# Altium schematic sheet Magnetometer_Channel.SchDoc: Hrafn
size Tabloid; DrawnBy: Nicholas Belsten; Organization: MIT; Address1: Route 40; Address2: Westford MA 01886; Address3: USA; DocumentNumber: 3; SheetNumber: 4; SheetTotal: 10; DCN: Aika; ProgramName: AERO-VISTA; Section: Magnetometer Channel
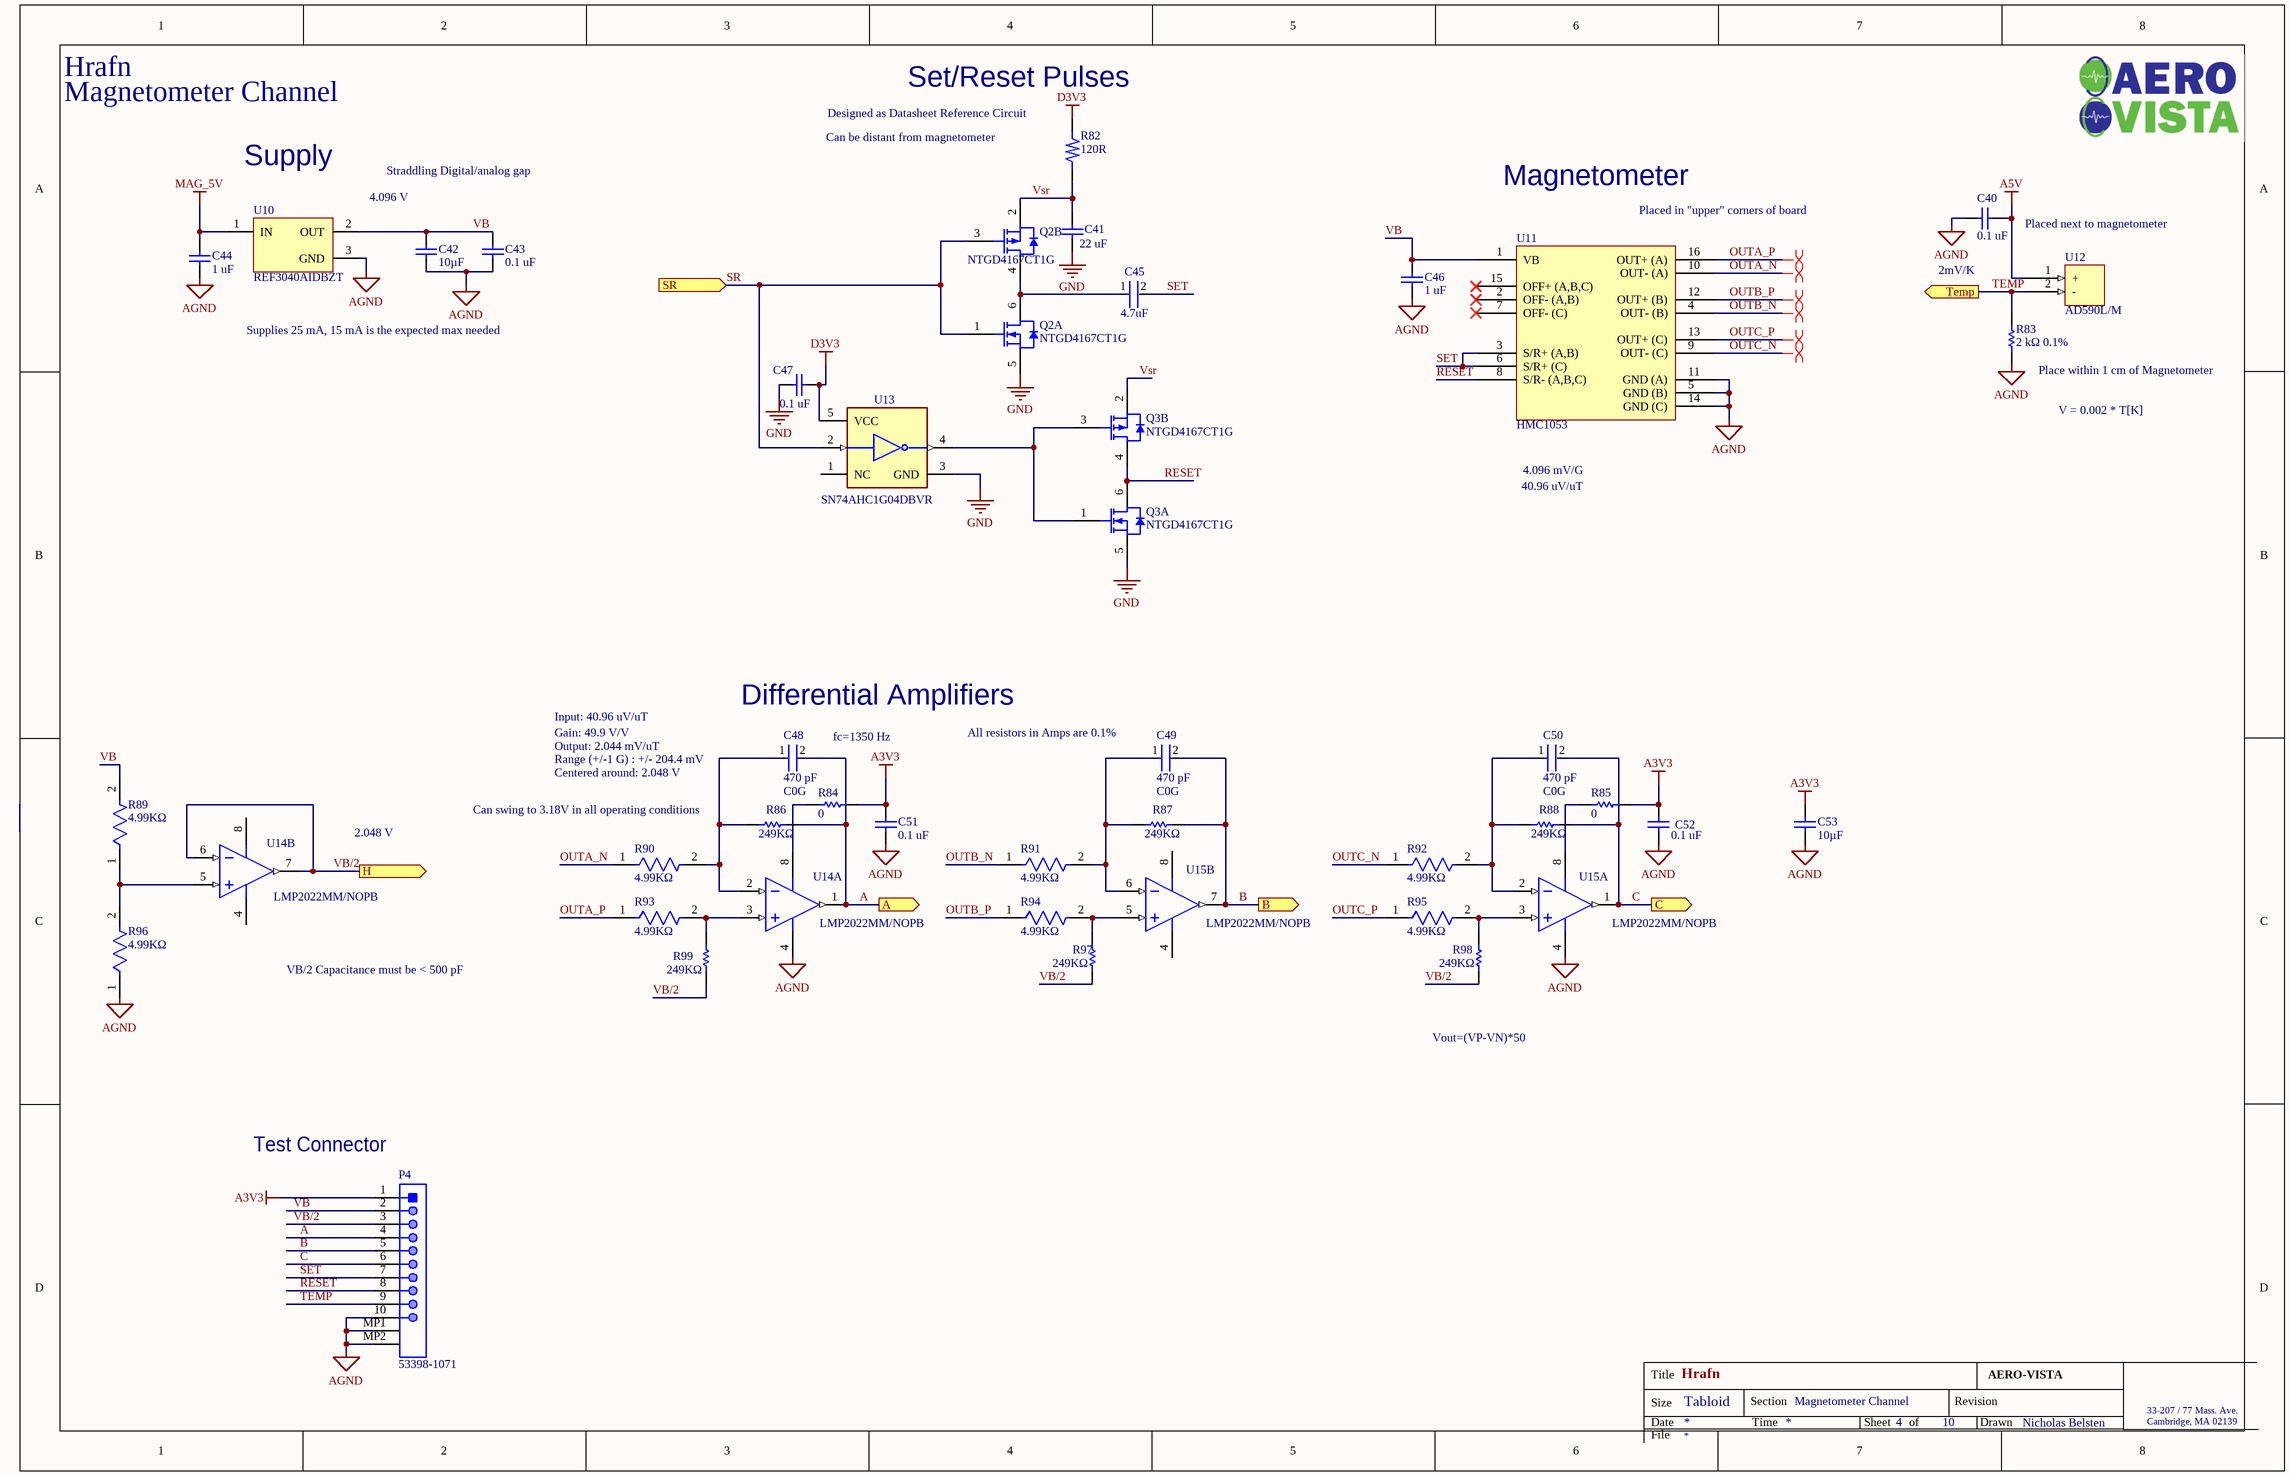
[diagram p0: Magnetometer_Channel.SchDoc]

## Parts
C40  0.1 uF  [CAPC0402(1005)60_L]
C41  Capacitance: 22 uF  [CAPC2013X95X45LL15T25]  (hidden comment: GRM219R61A226MEA0D)
C42  Capacitance: 10µF  [CAPC1608X100X35LL20T25]  (hidden comment: EMK107BBJ106MA-T)
C43  0.1 uF  [CAPC0402(1005)60_L]
C44  1 uF  [CAPC1005X60X30NL05T10]
C45  Capacitance: 4.7uF  [FP-GRM188-0_2-IPC_C]  (hidden comment: GRM188R6YA475KE15D)
C46  1 uF  [CAPC1005X60X30NL05T10]
C47  0.1 uF  [CAPC0402(1005)60_L]
C48  Capacitance: 470 pF  Temperature Characteristic: C0G  [FP-C0402-BB-MFG]  (hidden comment: C0402C471F5GACTU)
C49  Capacitance: 470 pF  Temperature Characteristic: C0G  [FP-C0402-BB-MFG]  (hidden comment: C0402C471F5GACTU)
C50  Capacitance: 470 pF  Temperature Characteristic: C0G  [FP-C0402-BB-MFG]  (hidden comment: C0402C471F5GACTU)
C51  0.1 uF  [CAPC0402(1005)60_L]
C52  0.1 uF  [CAPC0402(1005)60_L]
C53  Capacitance: 10µF  [CAPC1608X100X35LL20T25]  (hidden comment: EMK107BBJ106MA-T)
P4  53398-1071  [MOLX-53398-1071_V]
Q2  NTGD4167CT1G  [ONSC-TSOP-6-318G-02_V]  (parts A,B of 2)
Q3  NTGD4167CT1G  [ONSC-TSOP-6-318G-02_V]  (parts A,B of 2)
R82  Resistance: 120R  [RESC1608X08L]  (hidden comment: R)
R83  2 kΩ 0.1%  [RESC1005X40X25LL10T10]
R84  0  [RESC1608X55X25NL10T15]
R85  0  [RESC1608X55X25NL10T15]
R86  249KΩ  [RESC1609X55X30LL10T20]
R87  249KΩ  [RESC1609X55X30LL10T20]
R88  249KΩ  [RESC1609X55X30LL10T20]
R89  4.99KΩ  [FP-RT0603-IPC_B]
R90  4.99KΩ  [FP-RT0603-MFG]
R91  4.99KΩ  [FP-RT0603-IPC_B]
R92  4.99KΩ  [FP-RT0603-IPC_B]
R93  4.99KΩ  [FP-RT0603-IPC_B]
R94  4.99KΩ  [FP-RT0603-IPC_B]
R95  4.99KΩ  [FP-RT0603-IPC_B]
R96  4.99KΩ  [FP-RT0603-IPC_B]
R97  249KΩ  [RESC1609X55X30LL10T20]
R98  249KΩ  [RESC1609X55X30LL10T20]
R99  249KΩ  [RESC1609X55X30LL10T20]
U10  REF3040AIDBZT  [DBZ0003A_N]
U11  HMC1053  [LCC16]
U12  AD590L/M  [2-FLATPAK]
U13  SN74AHC1G04DBVR  [FP-DBV0005A-MFG]
U14  LMP2022MM/NOPB  [DGK0008A_L]  (parts A,B of 2)
U15  LMP2022MM/NOPB  [DGK0008A_L]  (parts A,B of 2)

## Ports
A (out), B (out), C (out), H (out), SR (in), Temp (out)

## Nets
A3V3: C51.2 C52.2 C53.2 P4.1 R84.2 R85.2
A5V: C40.1 U12.1(+)
AGND: C40.2 C42.1 C43.1 C44.1 C46.1 C51.1 C52.1 C53.1 P4.10 P4.MP1 P4.MP2 R83.1 R96.1 U10.3(GND) U11.5(GND_(B)) U11.11(GND_(A)) U11.14(GND_(C)) U14.4(V-) U15.4(V-)
D3V3: C47.2 R82.0 U13.5(VCC)
GND: C41.1 C47.1 Q2.5(S1) Q3.5(S1) U13.3(GND)
MAG_5V: C44.2 U10.1(IN)
A: C48.2 P4.4 R86.2 U14.1(OUTA) ; port A
B: C49.2 P4.5 R87.2 U15.7(OUTB) ; port B
C: C50.2 P4.6 R88.2 U15.1(OUTA) ; port C
OUTA_N: R90.1 U11.10(OUT-_(A))
OUTA_P: R93.1 U11.16(OUT+_(A))
OUTB_N: R91.1 U11.4(OUT-_(B))
OUTB_P: R94.1 U11.12(OUT+_(B))
OUTC_N: R92.1 U11.9(OUT-_(C))
OUTC_P: R95.1 U11.13(OUT+_(C))
RESET: P4.8 Q3.4(D2) Q3.6(D1) U11.8(S/R-_(A,B,C))
SET: C45.2 P4.7 U11.3(S/R+_(A,B)) U11.6(S/R+_(C))
SR: Q2.1(G1) Q2.3(G2) U13.2(A) ; port SR
TEMP: P4.9 R83.2 U12.2(-) ; port Temp
VB: C42.2 C43.2 C46.2 P4.2 R89.2 U10.2(OUT) U11.1(VB)
VB/2: P4.3 R97.1 R98.1 R99.1 U14.6(INB-) U14.7(OUTB) ; port H
Vsr: C41.2 Q2.2(S2) Q3.2(S2) R82.1
NetC45_1: C45.1 Q2.4(D2) Q2.6(D1)
NetC48_1: C48.1 R86.1 R90.2 U14.2(INA-)
NetC49_1: C49.1 R87.1 R91.2 U15.6(INB-)
NetC50_1: C50.1 R88.1 R92.2 U15.2(INA-)
NetQ3_1: Q3.1(G1) Q3.3(G2) U13.4(Y)
NetR84_1: R84.1 U14.8(V+)
NetR85_1: R85.1 U15.8(V+)
NetR89_1: R89.1 R96.2 U14.5(INB+)
NetR93_2: R93.2 R99.2 U14.3(INA+)
NetR94_2: R94.2 R97.2 U15.5(INB+)
NetR95_2: R95.2 R98.2 U15.3(INA+)

Not connected (* = marked no-connect by the designer): U11 2(OFF-_(A,B))* 7(OFF-_(C))* 15(OFF+_(A,B,C))*; U13 1(NC)

## Layout directives
differential pair; differential pair class ANALOG_DIFF: OUTA_N, OUTA_P, OUTB_N, OUTB_P, OUTC_N, OUTC_P

## Notes on the sheet
- (near R82) Set/Reset Pulses
- Can be distant from magnetometer
- (near R82) Designed as Datasheet Reference Circuit
- Supply
- 4.096 V
- Straddling Digital/analog gap
- Magnetometer
- (near U11) Placed in "upper" corners of board
- Placed next to magnetometer
- 2mV/K
- Supplies 25 mA, 15 mA is the expected max needed
- (near R83) Place within 1 cm of Magnetometer
- V = 0.002 * T[K]
- 40.96 uV/uT
- 4.096 mV/G
- Input: 40.96 uV/uT
- Gain: 49.9 V/V
- Output: 2.044 mV/uT
- Range (+/-1 G) : +/- 204.4 mV
- (near C48) Differential Amplifiers
- (near C48) fc=1350 Hz
- (near C49) All resistors in Amps are 0.1%
- (near R86) Can swing to 3.18V in all operating conditions
- Centered around: 2.048 V
- 2.048 V
- VB/2 Capacitance must be < 500 pF
- Vout=(VP-VN)*50
- (near P4) Test Connector
- Title
- Size
- Date
- Tabloid
- Section
- Time
- Sheet
- of
- Revision
- Drawn
- 33-207 / 77 Mass. Ave.
- Cambridge, MA 02139
- File

## Library data of the parts
C40 C43 C47 C51 C52 = CMP-1034-02068-1: CAP 100nF 16V ±5% 0402 (1005 Metric) Thickness 0.6mm SMD; Tolerance: Â±5%; Case-EIA: 0402; Case-Metric: 1005; Technology: SMT; Value: 100nF; Max Thickness: 0.6 mm; Rated Voltage: 16 V
C41 = CMP-2007-00096-1: Manufacturer: Murata; Part Number: GRM219R61A226MEA0D
C42 C53 = CMP-2000-06226-1: Chip Capacitor, 10 uF, +/- 20%, 16 V, -55 to 85 degC, 0603 (1608 Metric), RoHS, Tape and Reel; Manufacturer: Taiyo Yuden; Voltage - Rated: 16V; Temperature Coefficient: X5R; Other Names: 587-3238-6; Online Catalog: MSeries; Features: -; Thickness (Max): 0.031"(0.80mm); Package / Case: 0603(1608Metric); Datasheet URL: http://www.yuden.co.jp/ut/product/category/capacitor/EMK107BBJ106MA-T.pdf; Category: Capacitors; Lead Style: -; Family: CeramicCapacitors; Package Description: 2-Pin Surface Mount Device, Body 1.70 x 0.90 mm; Tolerance: ±20%; Manufacturer URL: http://www.t-yuden.com/; Operating Temperature: -55°C~85°C; Lead Spacing: -; Height - Seated (Max): -; Series: M; Applications: GeneralPurpose; Size / Dimension: 0.063"Lx0.031"W(1.60mmx0.80mm); Standard Package: 1; Packaging: Digi-Reel®; Mounting Technology: SurfaceMount; Package Reference: 0603; Ratings: -; Datasheet Version: 10/2016; Mounting Type: SurfaceMount,MLCC
C44 C46 = CMP-2008-02056-1: Part Number: C0402C105M8PACTU; Manufacturer: Kemet; Capacitance: 1 uF
C45 = CMP-2006-02545-2: Chip Multilayer Ceramic Capacitors for General Purpose, 0603, 4.7uF, X5R, 15%, 10%, 35V; Lead Free: Lead Free; Max Operating Temperature: 85°C; Case Code (Imperial): 0603; Width: 0.8mm; Thickness: 0.031inch; Case Code (Metric): 1608; Min Operating Temperature: -55°C; Voltage Rating (DC): 35V; Dielectric: X5R; Voltage: 35V; Packaging: Tape and Reel; Resistor Type: Ceramic; Weight: 0.000222oz; Mount: Surface Mount; Material: Ceramic; Depth: 0.8mm; Tolerance: 10%; REACH SVHC: No SVHC; Case/Package: 0603; Voltage Rating: 35V; Package Quantity: 4000; Height: 0.8mm; Length: 1.6mm; Termination: SMD/SMT
C48-C50 = CMP-1034-01497-3: CAP CER 470PF 50V NP0 0402; Manufacturer: Kemet; Material: Ceramic; Tolerance: 0.01; Temperature Coefficient: 15%; Manufacturer Part Number: C0402C471F5GACTU; Package: C0402-BB; ComponentLink2URL: https://content.kemet.com/datasheets/KEM_C1002_X7R_SMD.pdf; Ipc Land Pattern Name: CAPC10050X50; Height: 0.55mm; ComponentLink2Description: Datasheet; Value: 470 pF; Temperature: -55°C to +125°C; Temperature Range High: +125°C; Octopart: https://octopart.com/c0402c471f5gactu-kemet-13190944; Digikey Description: CAP CER 470PF 50V NP0 0402; Device Class L3: Ceramic Capacitors; Lead Free: Yes; Device Class L1: Passive Components; Voltage Rating: 50 V; RoHS: TRUE; Device Class L2: Capacitors; Temperature Range Low: -55°C; Category: Cap; Automotive: No; Mouser Description: Cap Ceramic 470pF 50V C0G 1% SMD 0402 125C Paper T/R
P4 = CMP-2000-05635-1: Male Header, Pitch 1.25 mm, 1 x 10 Position, Height 4.7 mm, -40 to 85 degC, RoHS, Tape and Reel; Manufacturer: Molex; Mounting Angle: Vertical; Pitch: 1.25mm; Voltage Rating: 125V; Current Rating: 1A; Number of Rows: 1Row; Housing Material: Nylon; Mounting Technology: SurfaceMount; Mounting Style: SMD; Contact Material: PhosphorBronze; Product: Headers; Datasheet URL: http://www.molex.com/pdm_docs/sd/533981071_sd.pdf; Manufacturer URL: http://www.molex.com/; Datasheet Version: Rev. J, 09/2015; Factory Pack Quantity: 1000; Brand: Molex; Packaging: Reel; Product Category: Headers&WireHousings; Contact Gender: Pin(Male); Number of Positions: 10Position; RoHS: Details; Contact Plating: Tin; Package Description: Male Header, Pitch 1.25 mm, 1 x 10 Position, Height 4.7 mm; Series: 53398; Type: Shrouded; Package Reference: 53398-1071; Tradename: PicoBlade; Termination Style: SMD
Q2 Q3 = CMP-1058-00959-1: Power MOSFET, Complementary, 30 V, +2.9 / -2.2 A, 6-Pin TSOP, Pb-Free, Tape and Reel; Manufacturer: On Semiconductor; Configuration: Dual; VGS(th) Max (V): 1.5; V(BR)DSS Min (V): 30; VGS Max (V): 12; ComponentLink3Description: Package Specification; PackageDescription: 6-Pin Small Outline Package, Body 3 x 1.5 mm, Pitch 0.95 mm; Channel Polarity: Complementary; PackageReference: TSOP-6-318G-02; Mounting Technology: Surface Mount; PackageVersion: Rev. V, 06/2012; Package Type: TSOP-6; ComponentLink3URL: http://www.onsemi.com/pub_link/Collateral/318G-02.PDF; Packing: Tape and Reel; PartNumber: NTGD4167CT1G; ComponentLink1Description: Manufacturer URL; ComponentLink2URL: http://www.onsemi.com/pub_link/Collateral/NTGD4167C-D.PDF; DatasheetVersion: Rev. 1; ComponentLink2Description: Datasheet; ComponentLink1URL: http://www.onsemi.com/; RoHS: Pb-Free
R82 = R: ROHM - ESR03EZPJ121 - RES, AEC-Q200, THICK FILM, 120R, 5%, 0603 ROHS COMPLIANT: YES; pin to pad: 0>2; Power Rating: 250mW; Temperature Coefficient: 200ppm/°C; Supplier 1: Digi-Key; Supplier Part Number 1: RHM120DCT-ND; Manufacturer 1: Rohm; Manufacturer Part Number 1: ESR03EZPJ121; RoHS: Yes; Category: Chip SMD Resistors; Stock 1: 21155; Pricing 1: 1=0.10000, 10=0.08200, 100=0.03160, 1000=0.01392, 2500=0.01202 (USD); Case/Package: 0603; Case Code (Metric): 1608; Case Code (Imperial): 0603; Size Code: 0603; Min Operating Temperature: -55°C; Max Operating Temperature: 155°C; Tolerance: 5%; Package Quantity: 1; Packaging: Tape and Reel; Resistor Type: Thick Film; Number of Terminations: 2; Max Power Dissipation: 250mW; Features: Automotive AEC-Q200; Series: ESR; Length: 0.063inch; Width: 0.031inch; Height: 0.022inch; Lead Free: Lead Free; RoHS Compliant: Yes; ComponentLink1URL: https://datasheet.ciiva.com/2495/esr-2495284.pdf?src-supplier=Digi-Key; ComponentLink1Description: https://datasheet.ciiva.com/2495/esr-2495284.pdf?src-supplier=Digi-Key; ComponentLink2URL: https://datasheet.ciiva.com/2495/esr-2495285.pdf?src-supplier=Digi-Key; ComponentLink2Description: https://datasheet.ciiva.com/2495/esr-2495285.pdf?src-supplier=Digi-Key; ComponentLink3URL: https://datasheet.ciiva.com/2495/esr-2495286.pdf?src-supplier=Digi-Key; ComponentLink3Description: https://datasheet.ciiva.com/2495/esr-2495286.pdf?src-supplier=Digi-Key
R83 = CMP-2002-05790-1: Manufacturer: Panasonic; Part Number: ERA-2AEB202X; Resistance: 2 kΩ 0.1%
R84 R85 = CMP-2100-03667-1: Chip Resistor, 0 Ohm, +/- 5%, 0.1 W, -55 to 155 degC, 0603 (1608 Metric), RoHS, Tape and Reel; Manufacturer: Yageo; Temperature Coefficient: 200ppm/degreesC; Voltage Rating: 50V; Power Rating: 100mW; Resistance: 0mOhm; Width: 0.8mm; Max Operating Temperature: 155degC; Tolerance: 5%; Package Reference: 0603; Height: 0.45mm; Depth: 0.8mm; Package Description: 2-Pin Surface Mount Device, Body 1.6 x 0.8 mm; Termination: SMD/SMT; Package Quantity: 5000; Case/Package: 0603; Case Code (Imperial): 0603; Radiation Hardening: No; Number of Pins: 2; Length: 1.6mm; Lead Free: LeadFree; Voltage Rating (DC): 50V; Military Standard: Not; Datasheet URL: http://www.yageo.com/NewPortal/yageodocoutput?fileName=/pdf/R-Chip/PYu-RC_Group_51_RoHS_L_5.pdf; Manufacturer URL: http://www.yageo.com/; Packaging: TapeandReel; Case Code (Metric): 1608; Min Operating Temperature: -55degC; Composition: ThickFilm; RoHSCompliant: true; Contact Plating: Tin; Datasheet Version: Rev. 5, 10/2016; REACH SVHC: NoSVHC
R86-R88 R97-R99 = CMP-2000-03736-1: Part Number: TNPW0603249KBEEA; Manufacturer: Vishay Dale; Resistance: 249KΩ
R89-R96 = CMP-03412-033519-1: RES SMD 4.99K OHM 0.1% 1/10W; Manufacturer Part Number: RT0603BRE074K99L; Manufacturer: Yageo; Power Rating: 0.1W; Voltage Rating: 75V; Temperature Coefficient: 50 ppm/°C; Tolerance: 0.001; Device Class L1: Passive Components; Resistance: 4.99KΩ; Package: RT0603; ComponentLink2URL: http://www.yageo.com/documents/recent/PYu-RT_1-to-0.01_RoHS_L_9.pdf; Temperature Range Low: -55°C; Temperature: -55°C to +155°C; Device Class L2: Resistors; Footprint Url: http://www.yageo.com/exep/pages/download/literatures/PYu-R_Mount_10.pdf; Digikey Description: RES SMD 4.99K OHM 0.1% 1/10W; Lead Free: Yes; Mouser Description: Res Thin Film 0603 4.99K Ohm 0.1% 1/10W ±50ppm/°C Molded SMD Paper T/R; Octopart: https://octopart.com/rt0603bre074k99l-yageo-1445653; ComponentLink2Description: Datasheet; Series: RT; Device Class L3: Chip SMD Resistors; Height: 0.55mm; Temperature Range High: +155°C; RoHS: TRUE; Composition: Thin Film; Value: 4.99KΩ; Category: Res; Automotive: No; Ipc Land Pattern Name: RESC16080X45
U10 = CMP-0367-00163-2: 4.096 V, 50 ppm / degC, 50 uA Series (Bandgap) Voltage Reference, -40 to 125 degC, 3-pin SOT-23 (DBZ), Green (RoHS & no Sb/Br); Manufacturer: Texas Instruments; Temp Coeff(Max)(ppm/ degree C): 50; SubFamily: Series Voltage Reference; Temp Coeff(Typ)(ppm/ degree C): 20; Initial Accuracy @ 25/deg C(%): 0.2; VI(Max)(V): 5.5; VO(V): 4.096; VI(Min)(V): 4.097; Rating: Catalog; PartNumber: REF3040AIDBZT; ComponentLink3Description: Package Specification; Iq(Max)(uA): 50; PackageVersion: 4203227/B; DatasheetVersion: SBVS032F; PackageReference: DBZ0003A; ComponentLink1URL: http://www.ti.com/; PackageDescription: 3-Pin Plastic Small Outline, Body 2.92 x 1.3 mm, Pitch 0.95 mm; Mounting Technology: Surface Mount; Eco-Plan: Green (RoHS & no Sb/Br); ComponentLink2URL: http://www.ti.com/general/docs/lit/getliterature.tsp?genericPartNumber=REF3040&fileType=pdf; Code_JEDEC: TO-236; ComponentLink1Description: Manufacturer URL; ComponentLink3URL: http://www.ti.com/litv/pdf/mpds108a; ComponentLink2Description: Datasheet
U11 = HMC1053: Manufacturer 1: Honeywell; Operating Supply Voltage: 3V; Output Type: Wheatstone Bridge; Sensing Method: Magnetoresistive; Axis: X, Y, Z; Nominal Supply Current: 500mA; Min Supply Voltage: 1.8V; Max Supply Voltage: 20V; Bandwidth: 5MHz; Supplier 1: Digi-Key; Manufacturer Part Number 1: HMC1053; Stock 1: 284; Pricing 1: 1=70.65000, 4=63.60000, 100=53.00010, 500=51.24000 (USD); RoHS: Yes; Case/Package: PLCC; Number of Pins: 16; Min Operating Temperature: -40°C; Max Operating Temperature: 125°C; Package Quantity: 66; Packaging: Tape and Reel; Length: 7.4mm; Height: 2.5mm; Width: 7.4mm; Radiation Hardening: No; ComponentLink1URL: https://datasheet.ciiva.com/15099/getdatasheetpartid-59250-15099355.pdf?src-supplier=Verical; ComponentLink1Description: https://datasheet.ciiva.com/15099/getdatasheetpartid-59250-15099355.pdf?src-supplier=Verical; ComponentLink2URL: https://datasheet.ciiva.com/2816/hmc-1051-1052-1053-data-sheet-2816521.pdf?src-supplier=Digi-Key; ComponentLink2Description: https://datasheet.ciiva.com/2816/hmc-1051-1052-1053-data-sheet-2816521.pdf?src-supplier=Digi-Key
U13 = CMP-0859-00023-4: IC INVERTER 1CH 1-INP SOT23-5; Manufacturer: Texas Instruments; Logic Function Desc: Inverting; Max Junction Temp: +150°C; Max Supply Voltage: 5.5V; Min Supply Voltage: 2V; Nominal Supply Current: 1uA; Number Of Circuits: 1; Propagation Delay: 5.3ns; Standoff Height: 0mm; Ambient Temperature Range High: +125°C; Ambient Temperature Range Low: -40°C; Automotive: No; Category: IC; ComponentLink2Description: Datasheet; ComponentLink2URL: http://www.ti.com/lit/ds/symlink/sn74ahc1g04.pdf; Device Class L1: Integrated Circuits (ICs); Device Class L2: Logic ICs; Device Class L3: Logic Gates; Digikey Description: IC INVERTER 1CH 1-INP SOT23-5; Height: 1.45mm; Ipc Land Pattern Name: SOT95P280X145-5; Lead Free: Yes; Manufacturer Part Number: SN74AHC1G04DBVR; Mouser Description: IC: digital; inverter; Channels: 1; Inputs: 1; SMD; SOT23-5; 2÷5.5VDC; Number Of Inputs: 1; Number Of Outputs: 1; Octopart: https://octopart.com/sn74ahc1g04dbvr-texas+instruments-464402; Package: DBV0005A; RoHS: TRUE; Temperature: -40°C to +125°C; Temperature Range High: +125°C; Temperature Range Low: -40°C
U14 U15 = CMP-0055-01527-3: Zero Drift, Low Noise, EMI Hardened Amplifier, 8-pin Mini SOIC, Pb-Free; Manufacturer: Texas Instruments; CompType: Amplifiers; PackageTopMarking: ZXTT*AV5A; PowerWise: N; PinCount: 8; Package Reference: DGK0008A; Code_JEDEC: MO-187-AA; PackageDescription: MINI SOIC, .118 x .118 x .034in, 8 Lead, .0256in Pitch; ComponentLink1Description: Datasheet URL; RoHS: Y; ComponentLink1URL: http://www.ti.com/general/docs/lit/getliterature.tsp?genericPartNumber=LMP2022&fileType=pdf
U12 = AD590L/M: Supplier 1: Digi-Key; Supplier 2: Digi-Key; Supplier Part Number 2: AD590LF-ND